# Altium schematic sheet 1602.SchDoc
size A4
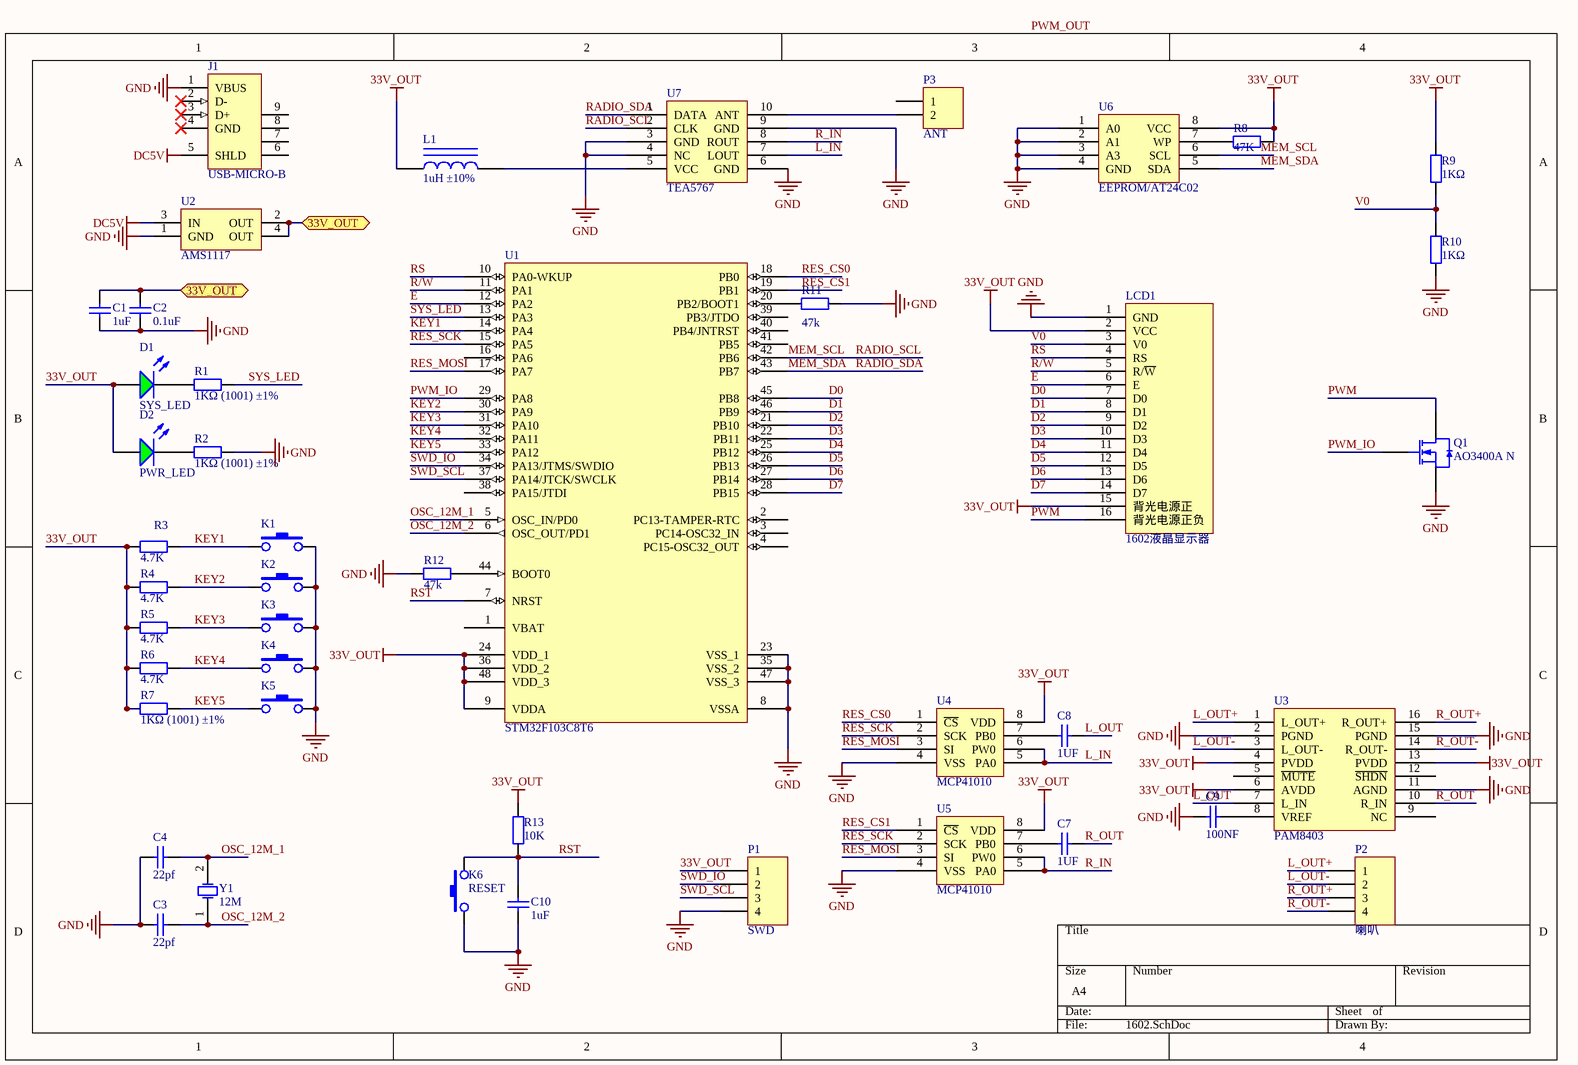
[diagram p0: 1602.SchDoc]

## Parts
C1  1uF  [LC-0805_C]
C2  0.1uF  [LC-0805_C]
C3  22pf  [LC-0805_C]
C4  22pf  [LC-0805_C]
C7  1UF  [LC-0805_C]
C8  1UF  [LC-0805_C]
C9  100NF  [LC-0805_C]
C10  1uF  [LC-0805_C]
D1  SYS_LED  [LC-0805_LED_S1]
D2  PWR_LED  [LC-0805_LED_S1]
J1  USB-MICRO-B  [Micro_USB]
K1  (no value)  [SW-SMD1]
K2  (no value)  [SW-SMD1]
K3  (no value)  [SW-SMD1]
K4  (no value)  [SW-SMD1]
K5  (no value)  [SW-SMD1]
K6  RESET  [SW-SMD1]
L1  1uH ±10%  [LC-0805_L]
LCD1  1602液晶显示器  [LCD1602A]
P1  SWD  [HDR1X4]
P2  喇叭  [HDR1X4]
P3  ANT  [HDR1X2]
Q1  AO3400A N  [LC-SOT-23-3L]
R1  1KΩ (1001) ±1%  [LC-0805_R]
R2  1KΩ (1001) ±1%  [LC-0805_R]
R3  4.7K  [LC-0805_R]
R4  4.7K  [LC-0805_R]
R5  4.7K  [LC-0805_R]
R6  4.7K  [LC-0805_R]
R7  1KΩ (1001) ±1%  [LC-0805_R]
R8  47K  [LC-0805_R]
R9  1KΩ  [LC-0805_R]
R10  1KΩ  [LC-0805_R]
R11  47k  [LC-0805_R]
R12  47k  [LC-0805_R]
R13  10K  [LC-0805_R]
U1  STM32F103C8T6  [TQFP48]
U2  AMS1117  [SOT223]
U3  PAM8403  [LC-SOP-16_208mil]
U4  MCP41010  [LC-SOP-8_150mil]
U5  MCP41010  [LC-SOP-8_150mil]
U6  EEPROM/AT24C02  [LC-SOIC-8_150mil]
U7  TEA5767  [TEA5767]
Y1  12M  [XTAL-RAD-0.2]

## Ports
33V_OUT

## Nets
33V_OUT: D1.A D2.A L1.1 LCD1.2(VCC) LCD1.15(背光电源正) P1.1 R3.1 R4.1 R5.1 R6.1 R7.1 R8.2 R9.2 R13.2 U1.9(VDDA) U1.24(VDD_1) U1.36(VDD_2) U1.48(VDD_3) U3.4(PVDD) U3.6(AVDD) U3.13(PVDD) U4.8(VDD) U5.8(VDD) U6.8(VCC)
DC5V: J1.5(SHLD) U2.3(IN)
GND: C1.1 C2.1 C3.1 C4.1 C9.1 C10.1 J1.1(VBUS) K1.2 K2.2 K3.2 K4.2 K5.2 K6.1 LCD1.1(GND) P1.4 Q1.2(S) R2.2 R10.1 R11.2 R12.1 U1.8(VSSA) U1.23(VSS_1) U1.35(VSS_2) U1.47(VSS_3) U2.1(GND) U3.2(PGND) U3.11(AGND) U3.15(PGND) U4.4(VSS) U5.4(VSS) U6.1(A0) U6.2(A1) U6.3(A3) U6.4(GND) U7.3(GND) U7.4(NC) U7.6(GND) U7.9(GND)
33V_OUT: C1.2 C2.2 U2.2(OUT) U2.4(OUT) ; port 33V_OUT  [a separate net that carries the same name]
D0: LCD1.7(D0) U1.45(PB8)
D1: LCD1.8(D1) U1.46(PB9)
D2: LCD1.9(D2) U1.21(PB10)
D3: LCD1.10(D3) U1.22(PB11)
D4: LCD1.11(D4) U1.25(PB12)
D5: LCD1.12(D5) U1.26(PB13)
D6: LCD1.13(D6) U1.27(PB14)
D7: LCD1.14(D7) U1.28(PB15)
E: LCD1.6(E) U1.12(PA2)
KEY1: K1.1 R3.2 U1.14(PA4)
KEY2: K2.1 R4.2 U1.30(PA9)
KEY3: K3.1 R5.2 U1.31(PA10)
KEY4: K4.1 R6.2 U1.32(PA11)
KEY5: K5.1 R7.2 U1.33(PA12)
L_IN: U4.5(PA0) U4.6(PW0) U7.7(LOUT)
L_OUT: C8.2 U3.7(L_IN)
L_OUT+: P2.1 U3.1(L_OUT+)
L_OUT-: P2.2 U3.3(L_OUT-)
MEM_SCL: U1.42(PB6) U6.6(SCL) U7.2(CLK)  [also labelled RADIO_SCL]
MEM_SDA: U1.43(PB7) U6.5(SDA) U7.1(DATA)  [also labelled RADIO_SDA]
OSC_12M_1: C4.2 U1.5(OSC_IN/PD0) Y1.2(OSC2)
OSC_12M_2: C3.2 U1.6(OSC_OUT/PD1) Y1.1(OSC1)
PWM: LCD1.16(背光电源正负) Q1.3(D)
PWM_IO: Q1.1(G) U1.29(PA8)
R/W: LCD1.5(R/~{W}) U1.11(PA1)
R_IN: U5.5(PA0) U5.6(PW0) U7.8(ROUT)
R_OUT: C7.2 U3.10(R_IN)
R_OUT+: P2.3 U3.16(R_OUT+)
R_OUT-: P2.4 U3.14(R_OUT-)
RES_CS0: U1.18(PB0) U4.1(~{CS})
RES_CS1: U1.19(PB1) U5.1(~{CS})
RES_MOSI: U1.17(PA7) U4.3(SI) U5.3(SI)
RES_SCK: U1.15(PA5) U4.2(SCK) U5.2(SCK)
RS: LCD1.4(RS) U1.10(PA0-WKUP)
RST: C10.2 K6.2 R13.1 U1.7(NRST)
SWD_IO: P1.2 U1.34(PA13/JTMS/SWDIO)
SWD_SCL: P1.3 U1.37(PA14/JTCK/SWCLK)
SYS_LED: R1.2 U1.13(PA3)
V0: LCD1.3(V0) R9.1 R10.2
NetC7_1: C7.1 U5.7(PB0)
NetC8_1: C8.1 U4.7(PB0)
NetC9_2: C9.2 U3.8(VREF)
NetD1_K: D1.K R1.1
NetD2_K: D2.K R2.1
NetL1_2: L1.2 U7.5(VCC)
NetP3_2: P3.2 U7.10(ANT)
NetR8_1: R8.1 U6.7(WP)
NetR11_1: R11.1 U1.20(PB2/BOOT1)
NetR12_2: R12.2 U1.44(BOOT0)

Not connected (* = marked no-connect by the designer): J1 2(D-)* 3(D+)* 4(GND)* 6(SHLD) 7(SHLD) 8(SHLD) 9(SHLD); P3 1; U1 1(VBAT) 2(PC13-TAMPER-RTC) 3(PC14-OSC32_IN) 4(PC15-OSC32_OUT) 16(PA6) 38(PA15/JTDI) 39(PB3/JTDO) 40(PB4/JNTRST) 41(PB5); U3 5(~{MUTE}) 9(NC) 12(~{SHDN})

## Notes on the sheet
- Labels drawn without touching a wire or pin: PWM_OUT

## Library data of the parts
C1-C4 C7-C10 = 0805 1uF (105) 10% 50V: 贴片电容; ComponentLink1Description: 供应商链接; ComponentLink1URL: http://www.szlcsc.com/product/details_29074.html; Package: 0805; Supplier: LC; SuppliersPartNumber: C28323
D1 D2 = 0805 翠绿: 发光二极管; ComponentLink1Description: 供应商链接; ComponentLink1URL: http://www.szlcsc.com/product/details_2670.html; Package: 0805; Supplier: LC; SuppliersPartNumber: C2297
J1 = USB-MICRO-B: USB 2.0, Right Angle, SMT, A Type, Receptacle, 5 Position, Black; ContactMaterial: Phosphor Bronze; ContactPlating: Gold (30) over Nickel; PCB_Layout: Complies with manufacturer's recommendation.; DrillSize: Corresponds to nominal value.; PanelGround: Without; Published: 15-Jul-2004; DatasheetDocument: 15-Nov-2002; PackageDocument: 15-Nov-2002; PackageReference: 440478; Publisher: Altium Limited; HousingMaterial: Thermoplastic; ComponentLink1Description: Manufacturer Link; ComponentLink1URL: http://www.tycoelectronics.com/; ComponentLink2Description: Packaging Specification; ComponentLink2URL: http://ecommas.tycoelectronics.com/commerce/DocumentDelivery/DDEController?Action=showdoc&DocId=Customer+Drawing%7F440478%7FB%7Fpdf%7FEnglish%7FC_440478_B.pdf
K1-K6 = BUTTON-S
L1 = 0805 1uH 10%: 贴片电感; ComponentLink1Description: 供应商链接; ComponentLink1URL: http://www.szlcsc.com/product/details_1394.html; Package: 0805; Supplier: LC; SuppliersPartNumber: C1042
P1 P2 = Header 4: Header, 4-Pin; LatestRevisionDate: 17-Jul-2002; LatestRevisionNote: Re-released for DXP Platform.; Publisher: Altium Limited
P3 = Header 2: Header, 2-Pin; LatestRevisionDate: 17-Jul-2002; LatestRevisionNote: Re-released for DXP Platform.; Publisher: Altium Limited
Q1 = AO3400A N道沟 X0YV1T SOT-23: MOS(场效应管); ComponentLink1Description: 供应商链接; ComponentLink1URL: http://www.szlcsc.com/product/details_21629.html; Package: SOT-23; Supplier: LC; SuppliersPartNumber: C20917
R1-R10 R13 = 0805 1KΩ (1001) 1%: 贴片电阻; ComponentLink1Description: 供应商链接; ComponentLink1URL: http://www.szlcsc.com/product/details_18201.html; Package: 0805; Supplier: LC; SuppliersPartNumber: C17513
R11 R12 = 0805 1.5KΩ (1501) 1%: 贴片电阻; ComponentLink1Description: 供应商链接; ComponentLink1URL: http://www.szlcsc.com/product/details_4717.html; Package: 0805; Supplier: LC; SuppliersPartNumber: C4310
U1 = STM32F103C8T6: STM32 ARM-based 32-bit MCU with 64 Kbytes Flash, 48-pin LQFP, Industrial Temperature; Published: 30-May-2008; DatasheetVersion: rev6, Mar-2008; PackageVersion: Mar-2008; PackageReference: LQFP48; Publisher: Altium Limited; PackageDescription: 48-Pin Low-Profile Quad Flat Pack, 7 x 7 mm Body, 0.5 mm Pitch (LQFP48); ComponentLink1Description: Manufacturer Link; ComponentLink1URL: www.st.com/stm32; ComponentLink2Description: Datasheet; ComponentLink2URL: http://www.st.com/stonline/products/literature/ds/13587.pdf
U2 = AMS1117: 800mA and 1A Low Dropout Positive Regulator 2.85V, 3.3V, 5V, and Adjustable; Published: 8-Jun-2000; LatestRevisionDate: 17-Jul-2002; LatestRevisionNote: Re-released for DXP Platform.; DatasheetVersion: Sep-1997; PackageVersion: revC; PackageReference: ZZ311; Publisher: Altium Limited; PackageDescription: SOT-223/SC-73; 4 Leads; Body 6.7 x 7.3 mm, inc. leads (LxW max); ComponentLink1Description: Manufacturer Link; ComponentLink1URL: http://www.ti.com/; ComponentLink2Description: Datasheet; ComponentLink2URL: http://www-s.ti.com/sc/ds/REG1117.pdf
U6 = EEPROM/AT24C256C-SSHL-T: EEPROM; ComponentLink1Description: 供应商链接; ComponentLink1URL: http://www.szlcsc.com/product/details_6947.html; Package: SOIC-8_150mil; Supplier: LC; SuppliersPartNumber: C6482
Y1 = XTAL: 晶体振荡器; Published: 8-Jun-2000; LatestRevisionDate: 17-Jul-2002; LatestRevisionNote: Re-released for DXP Platform.; PackageReference: R38; Publisher: Altium Limited